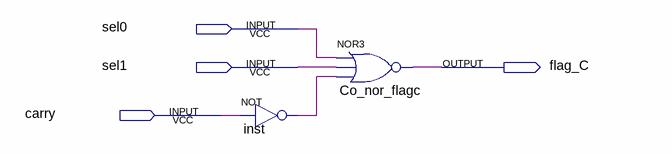
[diagram p0: schematic sheet]
// Quartus schematic flag_c.bdf as structural Verilog: 2 symbols, 4 pins
module flag_c (
  input  sel0,
  input  sel1,
  input  carry,
  output flag_C
);

  wire inst_out;

  not inst (inst_out, carry);
  nor Co_nor_flagc (flag_C, sel0, sel1, inst_out);
endmodule
